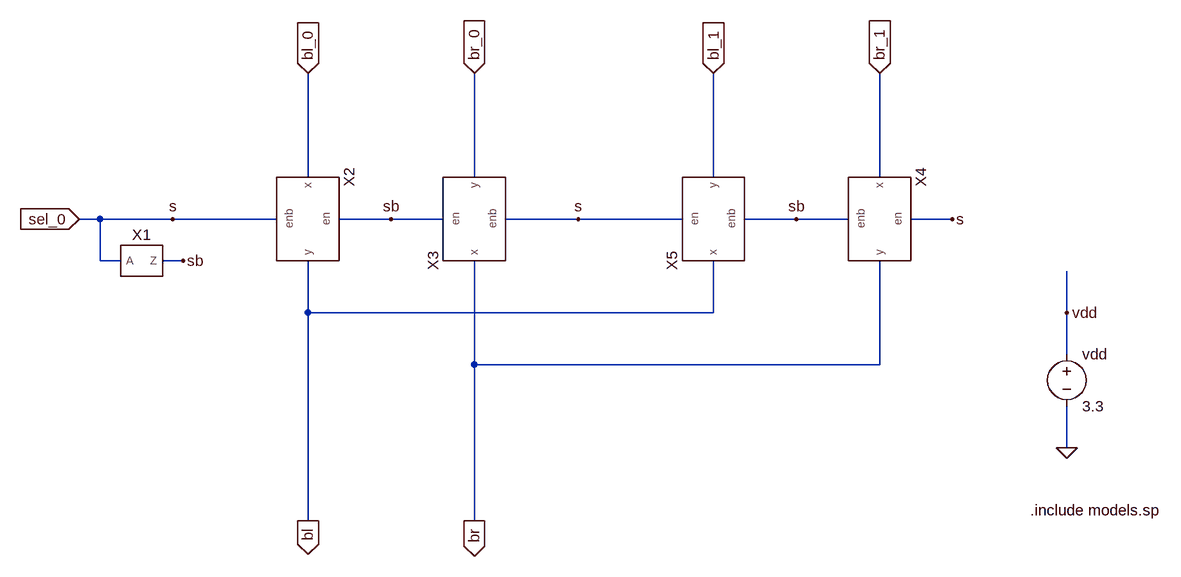
[diagram p0: schematic mux21.asc]
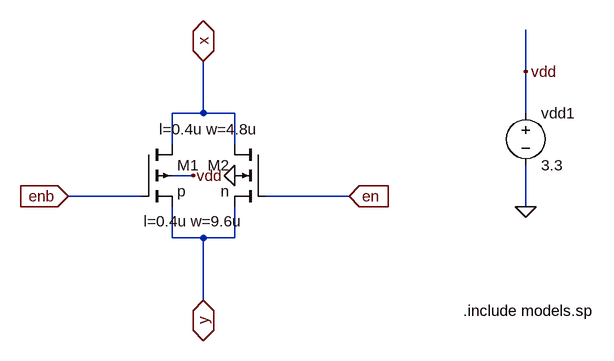
[diagram p1: sub-circuit tri_gate.asc]
mux21.asc, the LTspice schematic file:
Version 4
SHEET 1 1568 680
WIRE 240 -16 240 -176
WIRE 496 -16 496 -176
WIRE 864 -16 864 -176
WIRE 1120 -16 1120 -176
WIRE -80 48 -112 48
WIRE 32 48 -80 48
WIRE 192 48 32 48
WIRE 368 48 288 48
WIRE 448 48 368 48
WIRE 656 48 544 48
WIRE 816 48 656 48
WIRE 992 48 912 48
WIRE 1072 48 992 48
WIRE 1232 48 1168 48
WIRE -80 112 -80 48
WIRE -48 112 -80 112
WIRE 48 112 16 112
WIRE 240 192 240 112
WIRE 864 192 864 112
WIRE 864 192 240 192
WIRE 1408 192 1408 128
WIRE 1408 256 1408 192
WIRE 496 272 496 112
WIRE 1120 272 1120 112
WIRE 1120 272 496 272
WIRE 1408 400 1408 336
WIRE 240 512 240 192
WIRE 496 512 496 272
FLAG 1408 400 0
FLAG 1408 192 vdd
FLAG -112 48 sel_0
IOPIN -112 48 In
FLAG 240 -176 bl_0
IOPIN 240 -176 In
FLAG 496 -176 br_0
IOPIN 496 -176 In
FLAG 864 -176 bl_1
IOPIN 864 -176 In
FLAG 1120 -176 br_1
IOPIN 1120 -176 In
FLAG 240 512 bl
IOPIN 240 512 Out
FLAG 496 512 br
IOPIN 496 512 Out
FLAG 48 112 sb
FLAG 32 48 s
FLAG 656 48 s
FLAG 992 48 sb
FLAG 1232 48 s
FLAG 368 48 sb
SYMBOL voltage 1408 240 R0
WINDOW 123 0 0 Left 0
WINDOW 39 0 0 Left 0
SYMATTR InstName vdd
SYMATTR Value 3.3
SYMBOL inv -16 112 R0
SYMATTR InstName X1
SYMBOL tri_gate 240 48 R90
SYMATTR InstName X2
SYMBOL tri_gate 496 48 R270
SYMATTR InstName X3
SYMBOL tri_gate 1120 48 R90
SYMATTR InstName X4
SYMBOL tri_gate 864 48 R270
SYMATTR InstName X5
TEXT 1352 496 Left 2 !.include models.sp

tri_gate.asc, the sub-circuit schematic file:
Version 4
SHEET 1 880 680
WIRE 576 -16 576 -80
WIRE 80 48 80 -32
WIRE 80 48 32 48
WIRE 128 48 80 48
WIRE 576 48 576 -16
WIRE 32 96 32 48
WIRE 128 96 128 48
WIRE 64 144 32 144
WIRE -16 176 -128 176
WIRE 304 176 176 176
WIRE 576 192 576 128
WIRE 32 240 32 192
WIRE 80 240 32 240
WIRE 128 240 128 192
WIRE 128 240 80 240
WIRE 80 336 80 240
FLAG 128 144 0
FLAG 64 144 vdd
FLAG 576 192 0
FLAG 576 -16 vdd
FLAG 80 336 y
IOPIN 80 336 BiDir
FLAG 80 -32 x
IOPIN 80 -32 BiDir
FLAG 304 176 en
IOPIN 304 176 In
FLAG -128 176 enb
IOPIN -128 176 In
SYMBOL pmos4 -16 96 R0
WINDOW 123 4 118 Left 2
SYMATTR Value2 l=0.4u w=9.6u
SYMATTR InstName M1
SYMATTR Value p
SYMBOL nmos4 176 96 M0
WINDOW 123 12 -23 Left 2
SYMATTR Value2 l=0.4u w=4.8u
SYMATTR InstName M2
SYMATTR Value n
SYMBOL voltage 576 32 R0
WINDOW 123 0 0 Left 0
WINDOW 39 0 0 Left 0
SYMATTR InstName vdd1
SYMATTR Value 3.3
TEXT 480 352 Left 2 !.include models.sp

The netlist it stands for:
* mux21.asc
vdd vdd 0 3.3
XX1 s sb inv  ; pins A Z
XX2 sb s bl_0 bl tri_gate
XX3 sb s br br_0 tri_gate
XX4 s sb br_1 br tri_gate
XX5 s sb bl bl_1 tri_gate

* block symbol definitions
.subckt tri_gate en enb x y
M1 x enb y vdd p l=0.4u w=9.6u
M2 x en y 0 n l=0.4u w=4.8u
vdd1 vdd 0 3.3
.include models.sp
.ends tri_gate

.model NMOS NMOS
.model PMOS PMOS
.lib standard.mos
.include models.sp
.backanno
.end